# EAGLE design MDBT42Q (EAGLE 7.4.0)
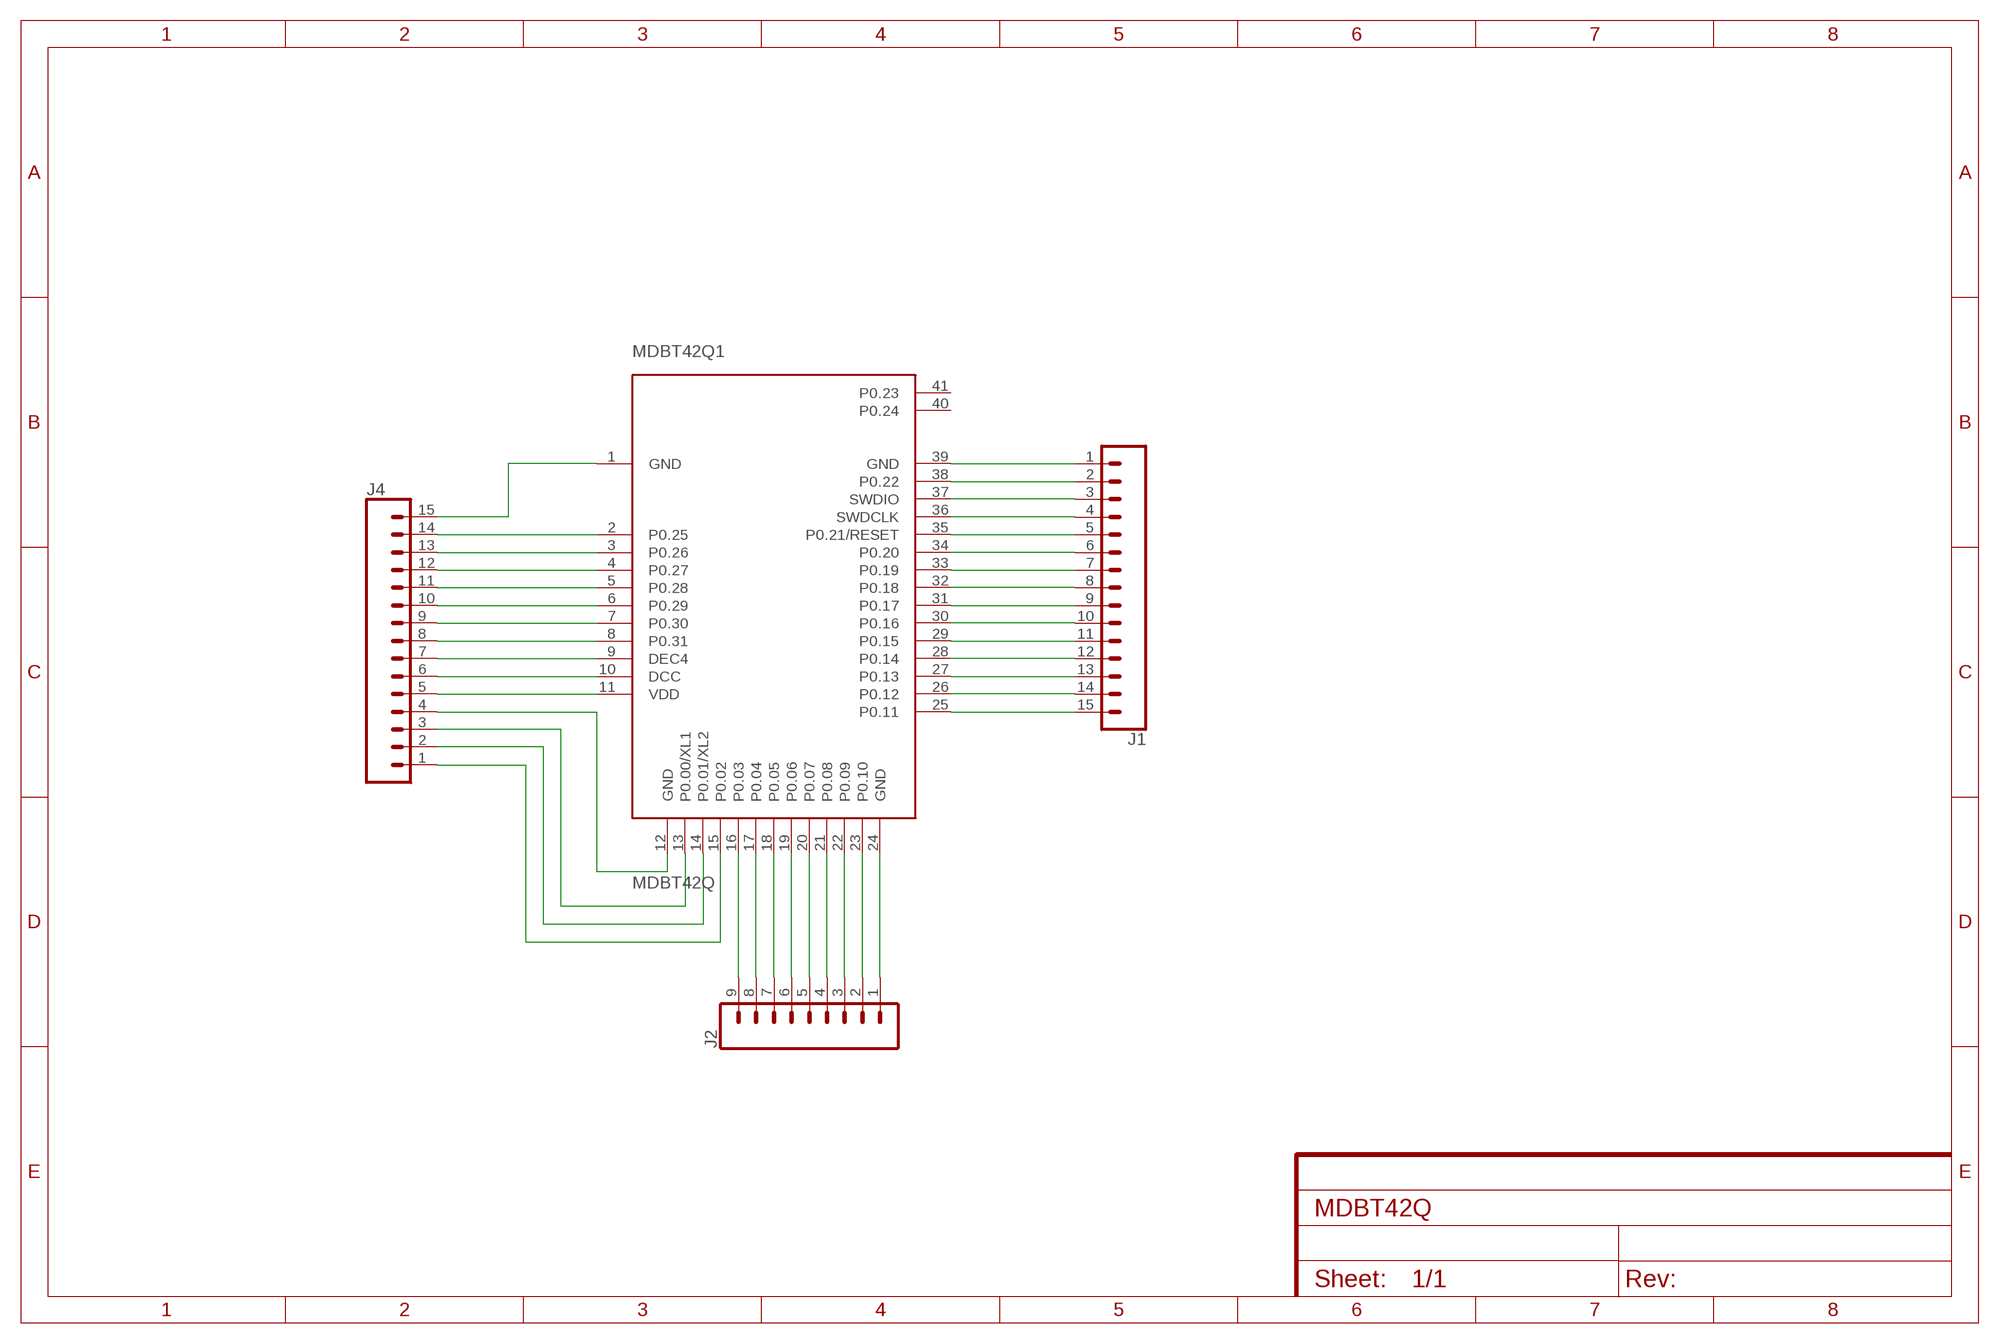
[diagram p0: schematic, sheet 1]

## Parts
J1  CONN_15  [1X15]
J2  CONN_09  [1X09]
J4  CONN_15  [1X15]
MDBT42Q1  MDBT42Q  [MDBT42Q]

## Nets
N$1: J4.15 MDBT42Q1.1(GND)
N$2: J4.14 MDBT42Q1.2(P0.25)
N$3: J4.13 MDBT42Q1.3(P0.26)
N$4: J4.12 MDBT42Q1.4(P0.27)
N$5: J4.11 MDBT42Q1.5(P0.28)
N$6: J4.10 MDBT42Q1.6(P0.29)
N$7: J4.9 MDBT42Q1.7(P0.30)
N$8: J4.8 MDBT42Q1.8(P0.31)
N$9: J4.7 MDBT42Q1.9(DEC4)
N$10: J4.6 MDBT42Q1.10(DCC)
N$11: J4.5 MDBT42Q1.11(VDD)
N$12: J4.4 MDBT42Q1.12(GND)
N$13: J4.3 MDBT42Q1.13(P0.00/XL1)
N$14: J4.2 MDBT42Q1.14(P0.01/XL2)
N$15: J4.1 MDBT42Q1.15(P0.02)
N$16: J2.9 MDBT42Q1.16(P0.03)
N$17: J2.8 MDBT42Q1.17(P0.04)
N$18: J2.5 MDBT42Q1.20(P0.07)
N$19: J2.6 MDBT42Q1.19(P0.06)
N$20: J2.7 MDBT42Q1.18(P0.05)
N$21: J2.4 MDBT42Q1.21(P0.08)
N$22: J2.3 MDBT42Q1.22(P0.09)
N$23: J2.2 MDBT42Q1.23(P0.10)
N$24: J2.1 MDBT42Q1.24(GND)
N$25: J1.15 MDBT42Q1.25(P0.11)
N$26: J1.14 MDBT42Q1.26(P0.12)
N$27: J1.13 MDBT42Q1.27(P0.13)
N$28: J1.12 MDBT42Q1.28(P0.14)
N$29: J1.11 MDBT42Q1.29(P0.15)
N$30: J1.10 MDBT42Q1.30(P0.16)
N$31: J1.9 MDBT42Q1.31(P0.17)
N$32: J1.8 MDBT42Q1.32(P0.18)
N$33: J1.7 MDBT42Q1.33(P0.19)
N$34: J1.6 MDBT42Q1.34(P0.20)
N$35: J1.5 MDBT42Q1.35(P0.21/RESET)
N$36: J1.4 MDBT42Q1.36(SWDCLK)
N$37: J1.3 MDBT42Q1.37(SWDIO)
N$38: J1.2 MDBT42Q1.38(P0.22)
N$39: J1.1 MDBT42Q1.39(GND)
Unconnected: MDBT42Q1.40(P0.24) MDBT42Q1.41(P0.23)

## Library data of the parts
J1 J4 = SparkFun-Connectors:CONN_15: Multi connection point. Often used as Generic Header-pin footprint for 0.1 inch spaced/style header connections On any of the 0.1 inch spaced packages, you can populate with these: Break Away Headers - Straight <https://www.sparkfun.com/products/116> (PRT-00116) Break Away Male Headers - Right Angle <https://www.sparkfun.com/products/553> (PRT-00553) Female Headers <https://www.sparkfun.com/products/115> (PRT-00115) Break Away Headers - Machine Pin <https://www.sparkfun.com/products/117> (PRT-00117) Break Away Female Headers - Swiss Machine Pin <https://www.sparkfun.com/products/743> (PRT-00743) For SCREWTERMINALS and SPRING TERMINALS visit here: Screw Terimnals on SparkFun.com <https://www.sparkfun.com/search/results?term=Screw+Terminals> (5mm/3.5mm/2.54mm spacing) This device is also useful as a general connection point to wire up your design to another part of your project. Our various solder wires solder well into these plated through hole pads. Hook-Up Wire - Assortment (Stranded, 22 AWG) <https://www.sparkfun.com/products/11375> (PRT-11375) Hook-Up Wire - Assortment (Solid Core, 22 AWG) <https://www.sparkfun.com/products/11367> (PRT-11367) View the entire wire category on our website here <https://www.sparkfun.com/categories/141> Special notes: Molex polarized connector foot print use with SKU : PRT-08231 with associated crimp pins and housings. 1MM SMD Version SKU: PRT-10208 NOTES ON THE VARIANTS LOCK and LOCK_LONGPADS... This footprint was designed to help hold the alignment of a through-hole component (i.e. 6-pin header) while soldering it into place. You may notice that each hole has been shifted either up or down by 0.005 of an inch from it's more standard position (which is a perfectly straight line). This slight alteration caused the pins (the squares in the middle) to touch the edges of the holes. Because they are alternating, it causes a "brace" to hold the component in place. 0.005 has proven to be the perfect amount of "off-center" position when using our standard breakaway headers. Although looks a little odd when you look at the bare footprint, once you have a header in there, the alteration is very hard to notice. Also,if you push a header all the way into place, it is covered up entirely on the bottom side.
J2 = SparkFun-Connectors:CONN_09: Multi connection point. Often used as Generic Header-pin footprint for 0.1 inch spaced/style header connections On any of the 0.1 inch spaced packages, you can populate with these: Break Away Headers - Straight <https://www.sparkfun.com/products/116> (PRT-00116) Break Away Male Headers - Right Angle <https://www.sparkfun.com/products/553> (PRT-00553) Female Headers <https://www.sparkfun.com/products/115> (PRT-00115) Break Away Headers - Machine Pin <https://www.sparkfun.com/products/117> (PRT-00117) Break Away Female Headers - Swiss Machine Pin <https://www.sparkfun.com/products/743> (PRT-00743) For SCREWTERMINALS and SPRING TERMINALS visit here: Screw Terimnals on SparkFun.com <https://www.sparkfun.com/search/results?term=Screw+Terminals> (5mm/3.5mm/2.54mm spacing) This device is also useful as a general connection point to wire up your design to another part of your project. Our various solder wires solder well into these plated through hole pads. Hook-Up Wire - Assortment (Stranded, 22 AWG) <https://www.sparkfun.com/products/11375> (PRT-11375) Hook-Up Wire - Assortment (Solid Core, 22 AWG) <https://www.sparkfun.com/products/11367> (PRT-11367) View the entire wire category on our website here <https://www.sparkfun.com/categories/141> Special notes: Molex polarized connector foot print use with SKU : PRT-08231 with associated crimp pins and housings. 1MM SMD Version SKU: PRT-10208 NOTES ON THE VARIANTS LOCK and LOCK_LONGPADS... This footprint was designed to help hold the alignment of a through-hole component (i.e. 6-pin header) while soldering it into place. You may notice that each hole has been shifted either up or down by 0.005 of an inch from it's more standard position (which is a perfectly straight line). This slight alteration caused the pins (the squares in the middle) to touch the edges of the holes. Because they are alternating, it causes a "brace" to hold the component in place. 0.005 has proven to be the perfect amount of "off-center" position when using our standard breakaway headers. Although looks a little odd when you look at the bare footprint, once you have a header in there, the alteration is very hard to notice. Also,if you push a header all the way into place, it is covered up entirely on the bottom side.
MDBT42Q1 = MDBT42Q_170329:MDBT42Q: Raytac Corporation MDBT42Q-512K, MDBT42Q-P512K Bluetooth Low Energy Module based on Noridc nRF52832 Source: Raytac datasheet

## Board
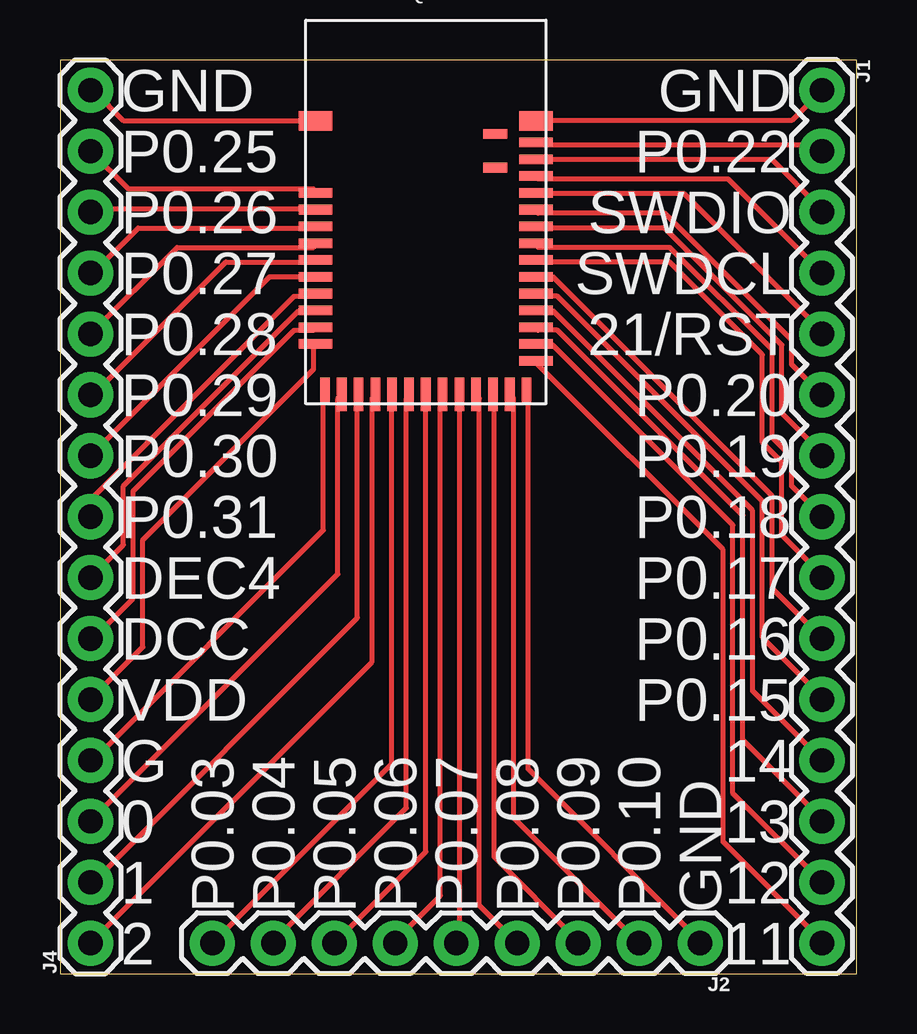
[diagram p1: board, top side]

Size 33.2 x 38.09 mm. Coordinates in mm from the lower left corner, seen from the top.
Outline: 0,0 33.2,0 33.2,38.09 0,38.09 0,0
Copper layers (1*16): Top 0.035mm / dielectric 1.5mm / Bottom 0.035mm
Design rules "SparkFun": minimum track width 8mil, minimum drill 20mil, track to track 8mil, track to pad 8mil, pad to pad 8mil, via to via 8mil, smd to smd 8mil, copper to edge 8mil, drill to drill 8mil, minimum pad ring 12mil, minimum via ring 10mil, stop-mask expansion 4mil, vias tented up to drill 20mil, thermal gap 10mil

### Footprints (pad centres in the part's own frame; a part is rotated, then mirrored left to right if it is on the bottom)
1X15 = drill 1.016 pad 1.88: 1 0,0; 2 2.54,0; 3 5.08,0; 4 7.62,0; 5 10.16,0; 6 12.7,0; 7 15.24,0; 8 17.78,0; 9 20.32,0; 10 22.86,0; 11 25.4,0; 12 27.94,0; 13 30.48,0; 14 33.02,0; 15 35.56,0
1X09 = drill 1.016 pad 1.88: 1 0,0; 2 2.54,0; 3 5.08,0; 4 7.62,0; 5 10.16,0; 6 12.7,0; 7 15.24,0; 8 17.78,0; 9 20.32,0
MDBT42Q = smd 1.4 x 0.8: 1 -4.6,3.8; 39 4.6,3.8 | smd 1.4 x 0.4: 2 -4.6,0.8; 3 -4.6,0.1; 4 -4.6,-0.6; 5 -4.6,-1.3; 6 -4.6,-2; 7 -4.6,-2.7; 8 -4.6,-3.4; 9 -4.6,-4.1; 10 -4.6,-4.8; 11 -4.6,-5.5; 25 4.6,-6.2; 26 4.6,-5.5; 27 4.6,-4.8; 28 4.6,-4.1; 29 4.6,-3.4; 30 4.6,-2.7; 31 4.6,-2; 32 4.6,-1.3; 33 4.6,-0.6; 34 4.6,0.1; 35 4.6,0.8; 36 4.6,1.5; 37 4.6,2.2; 38 4.6,2.9 | smd 0.4 x 1.1: 12 -4.2,-7.45; 24 4.2,-7.45 | smd 0.4 x 1.4: 13 -3.5,-7.6; 14 -2.8,-7.6; 15 -2.1,-7.6; 16 -1.4,-7.6; 17 -0.7,-7.6; 18 0,-7.6; 19 0.7,-7.6; 20 1.4,-7.6; 21 2.1,-7.6; 22 2.8,-7.6; 23 3.5,-7.6 | smd 1 x 0.4: 40 2.9,3.25; 41 2.9,1.85

### Placement (x,y rotation side)
J1  31.75,36.83 270 top
J2  26.67,1.27 180 top
J4  1.27,1.27 90 top
MDBT42Q1  15.24,31.75 0 top

### Tracks (layer width: path | path; a pad name or v marks a point on that pad's centre or on a via)
N$1
  Top 0.203: MDBT42Q1.1 10.57,35.56 2.64,35.56 1.42,36.78 J4.15
N$2
  Top 0.203: J4.14 2.85,32.72 10.57,32.72 MDBT42Q1.2
N$3
  Top 0.203: MDBT42Q1.3 10.57,31.9 1.42,31.9 J4.13
N$4
  Top 0.203: MDBT42Q1.4 10.57,31.09 3.25,31.09 1.42,29.26 J4.12
N$5
  Top 0.203: J4.11 4.88,30.28 10.57,30.28 MDBT42Q1.5
N$6
  Top 0.203: MDBT42Q1.6 10.57,29.67 6.91,29.67 1.42,24.18 J4.10
N$7
  Top 0.203: J4.9 8.74,29.06 10.57,29.06 MDBT42Q1.7
N$8
  Top 0.203: MDBT42Q1.8 10.57,28.25 9.75,28.25 1.42,19.91 1.42,19.1 J4.8
N$9
  Top 0.203: J4.7 2.64,17.88 2.64,20.32 9.96,27.64 10.57,27.64 MDBT42Q1.9
N$10
  Top 0.203: MDBT42Q1.10 10.57,26.82 9.75,26.82 3.05,20.12 3.05,15.65 1.42,14.02 J4.6
N$11
  Top 0.203: J4.5 3.45,13.61 3.45,18.09 10.57,25.2 10.57,26.21 MDBT42Q1.11
N$12
  Top 0.203: MDBT42Q1.12 10.97,24.18 10.97,18.49 1.42,8.94 J4.4
N$13
  Top 0.203: J4.3 11.58,16.66 11.58,23.98 MDBT42Q1.13
N$14
  Top 0.203: MDBT42Q1.14 12.39,23.98 12.39,14.83 1.42,3.86 J4.2
N$15
  Top 0.203: J4.1 13.01,13.01 13.01,23.98 MDBT42Q1.15
N$16
  Top 0.203: J2.9 13.82,8.74 13.82,23.98 MDBT42Q1.16
N$17
  Top 0.203: MDBT42Q1.17 14.43,23.98 14.43,6.91 8.94,1.42 J2.8
N$18
  Top 0.203: MDBT42Q1.20 16.66,23.98 16.66,1.42 J2.5
N$19
  Top 0.203: MDBT42Q1.19 15.85,23.98 15.85,3.25 14.02,1.42 J2.6
N$20
  Top 0.203: MDBT42Q1.18 15.24,5.08 J2.7
N$21
  Top 0.203: J2.4 17.48,2.85 17.48,23.98 MDBT42Q1.21
N$22
  Top 0.203: MDBT42Q1.22 18.09,23.98 18.09,4.88 21.54,1.42 J2.3
N$23
  Top 0.203: J2.2 18.9,6.5 18.9,23.98 MDBT42Q1.23
N$24
  Top 0.203: MDBT42Q1.24 19.51,24.18 19.51,8.53 26.62,1.42 J2.1
N$25
  Top 0.203: MDBT42Q1.25 19.91,25.4 27.64,17.68 27.64,5.49 31.7,1.42 J1.15
N$26
  Top 0.203: J1.14 28.04,7.52 28.04,18.69 20.52,26.21 19.91,26.21 MDBT42Q1.26
N$27
  Top 0.203: MDBT42Q1.27 19.91,26.82 20.73,26.82 28.45,19.1 28.45,9.75 31.7,6.5 J1.13
N$28
  Top 0.203: J1.12 28.85,11.79 28.85,19.3 20.52,27.64 19.91,27.64 MDBT42Q1.28
N$29
  Top 0.203: MDBT42Q1.29 19.91,28.25 20.73,28.25 29.26,19.71 29.26,14.02 31.7,11.58 J1.11
N$30
  Top 0.203: J1.10 29.67,16.05 29.67,19.91 20.52,29.06 19.91,29.06 MDBT42Q1.30
N$31
  Top 0.203: MDBT42Q1.31 19.91,29.67 25.4,29.67 29.26,25.81 29.26,22.15 30.07,21.34 30.07,18.29 31.7,16.66 J1.9
N$32
  Top 0.203: J1.8 30.48,20.32 30.48,21.54 29.67,22.35 29.67,26.01 25.4,30.28 19.91,30.28 MDBT42Q1.32
N$33
  Top 0.203: MDBT42Q1.33 19.91,31.09 25.2,31.09 30.07,26.21 30.07,23.37 31.7,21.74 J1.7
N$34
  Top 0.203: J1.6 30.48,25.4 30.48,26.42 25.2,31.7 19.91,31.7 MDBT42Q1.34
N$35
  Top 0.203: MDBT42Q1.35 19.91,32.51 26.01,32.51 31.7,26.82 J1.5
N$36
  Top 0.203: J1.4 27.84,33.12 19.91,33.12 MDBT42Q1.36
N$37
  Top 0.203: MDBT42Q1.37 19.91,33.93 29.67,33.93 31.7,31.9 J1.3
N$38
  Top 0.203: J1.2 31.5,34.54 19.91,34.54 MDBT42Q1.38
N$39
  Top 0.203: J1.1 30.48,35.56 19.91,35.56 MDBT42Q1.39

### Text on the board
tPlace: GND | GND | P0.25 | P0.22 | P0.26 | SWDIO | P0.27 | SWDCL | P0.28 | 21/RST | P0.29 | P0.20 | P0.30 | P0.19 | P0.31 | P0.18 | DEC4 | P0.17 | DCC | P0.16 | VDD | P0.15 | G | 14 | 0 | 13 | 1 | 12 | P0.03 | P0.04 | P0.05 | P0.06 | P0.07 | P0.08 | P0.09 | P0.10 | GND | 2 | 11